# EasyEDA Pro project 最小系统板.eprj

# Schematic Schematic1
Board Name: Board1; Create Date: 2025-12-22; Page Name: P1; Project Name: 最小系统板; Schematic Name: Schematic1; Update Date: 2025-12-23; Company: 嘉立创EDA; Page Size: A4; Version: V1.0
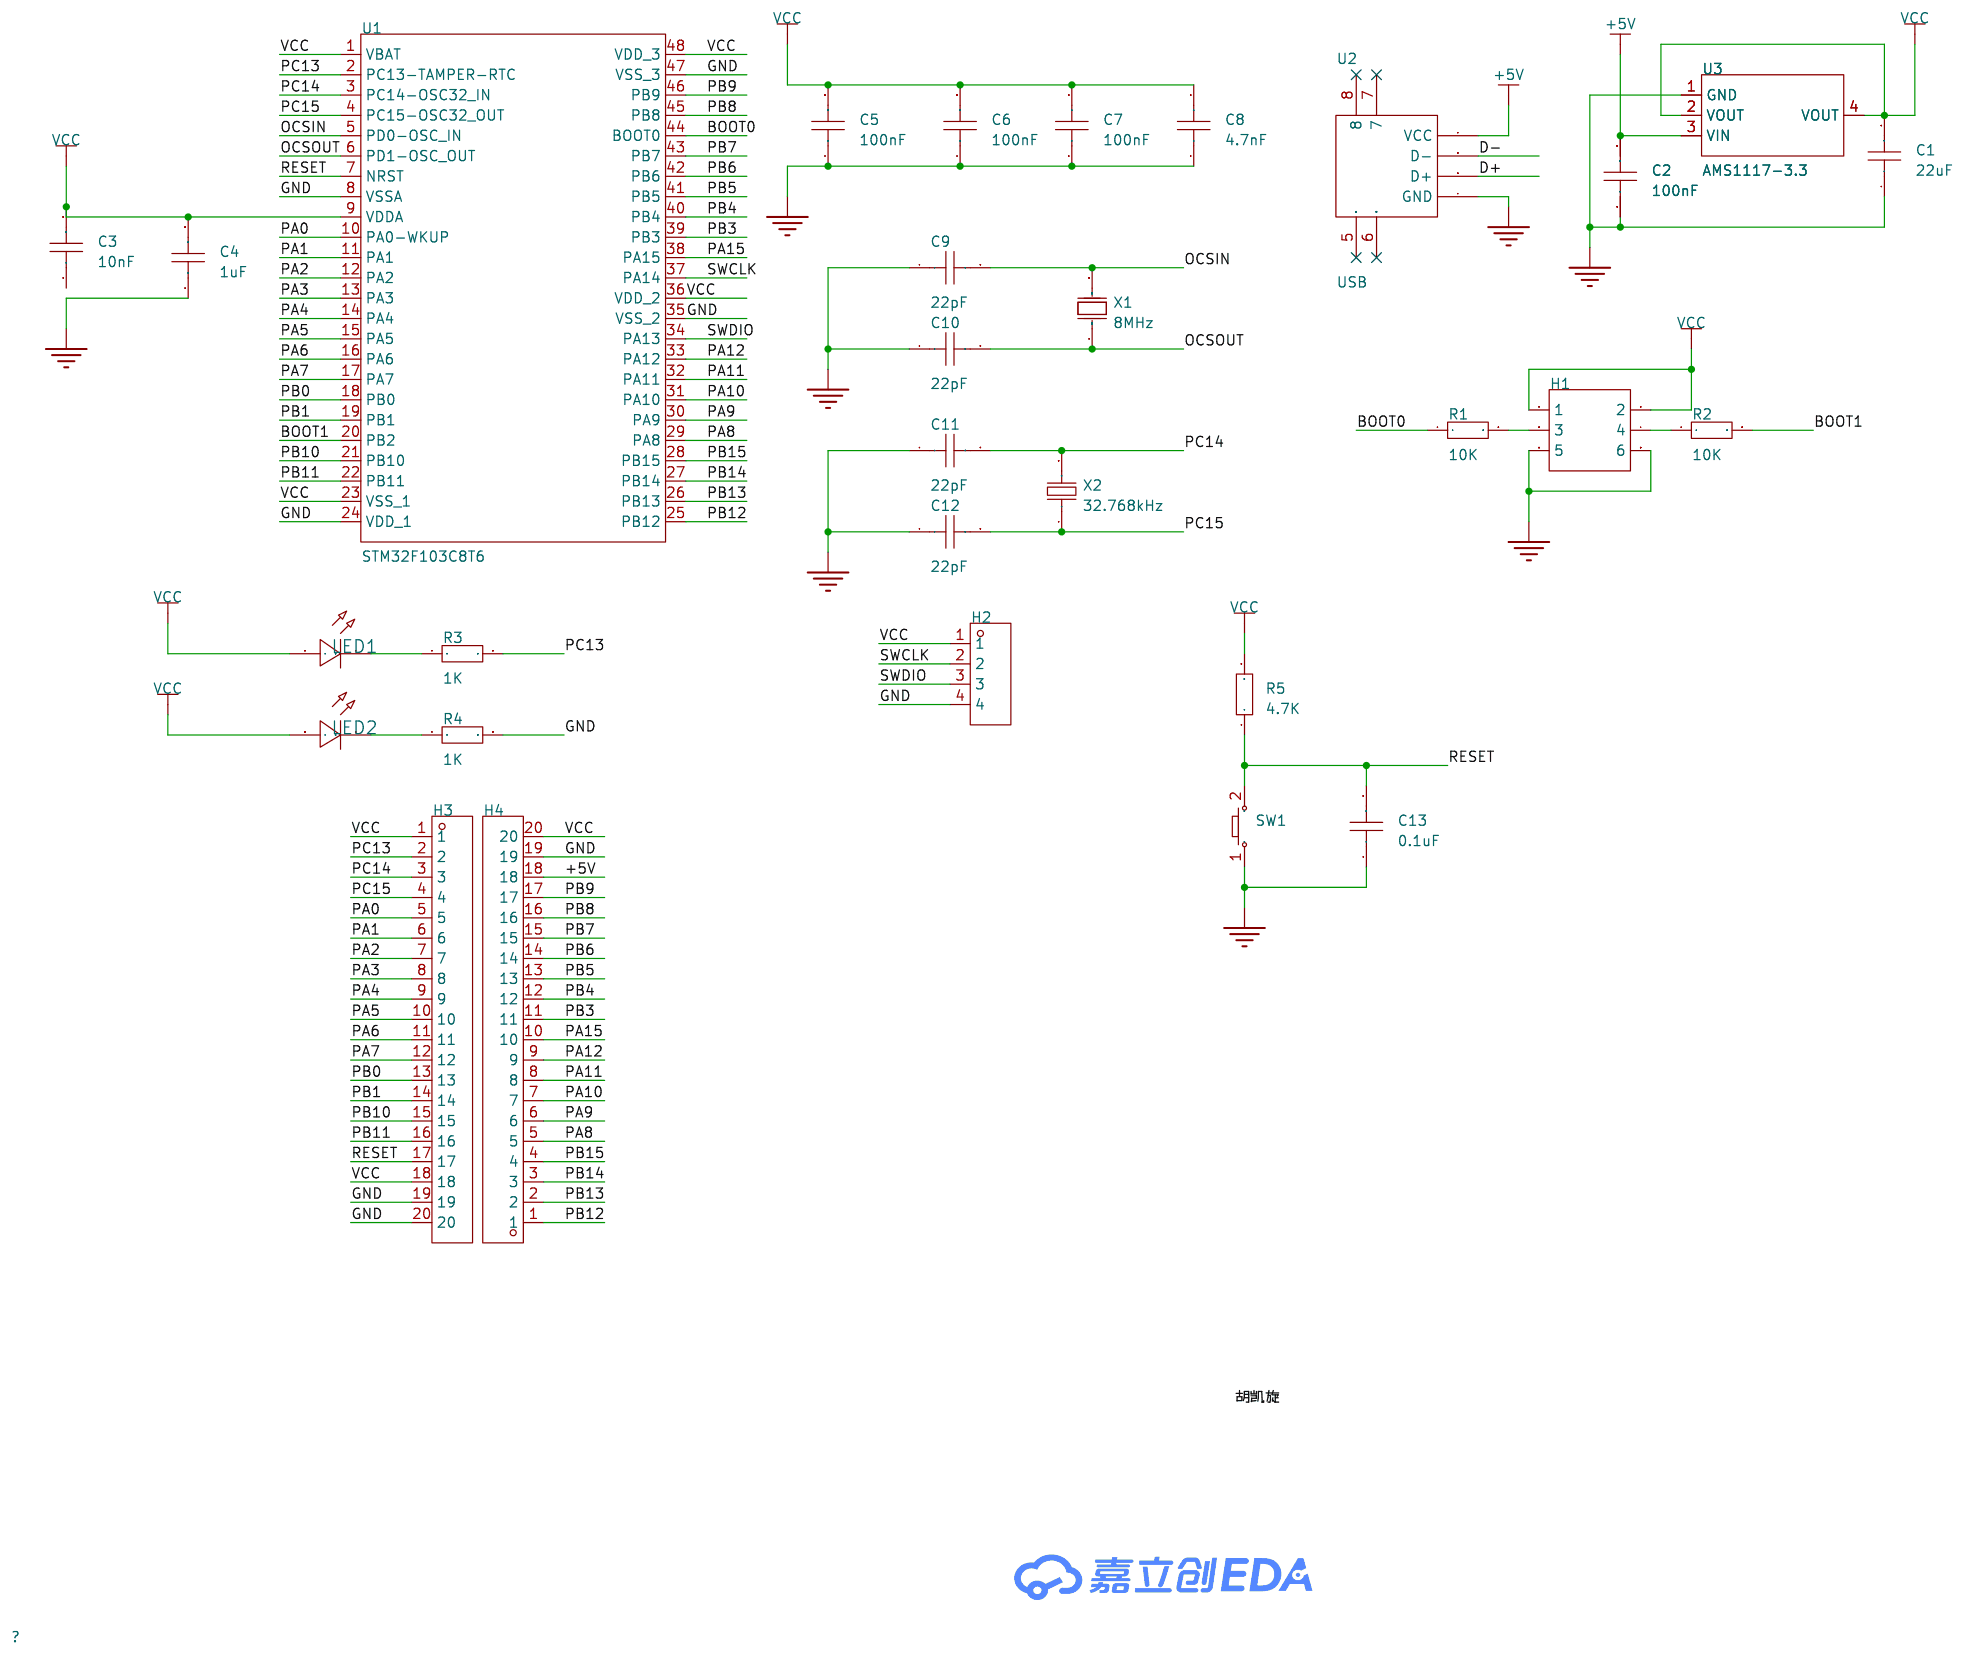
[diagram p0: schematic sheet]

## Parts
C1  22uF  [C0603]
C2  100nF  [C0603]
C3  10nF  [C0603]
C4  1uF  [C0603]
C5  100nF  [C0603]
C6  100nF  [C0603]
C7  100nF  [C0603]
C8  4.7nF  [C0603]
C9  22pF  [C0603]
C10  22pF  [C0603]
C11  22pF  [C0603]
C12  22pF  [C0603]
C13  0.1uF  [C0603]
H1  -  [HDR-TH_6P-P2.54-V-F-R2-C3-S2.54]
H2  -  [HDR-TH_4P-P2.54-V-M]
H3  -  [HDR-TH_20P-P2.54-V-M-1]
H4  -  [HDR-TH_20P-P2.54-V-M-1]
LED1  -  [LED_0603]
LED2  -  [LED_0603]
R1  10K  [R0603]
R2  10K  [R0603]
R3  1K  [R0603]
R4  1K  [R0603]
R5  4.7K  [R0603]
SW1  -  [Key_SMD_3x4x2]
U1  STM32F103C8T6  [LQFP-48_L7.0-W7.0-P0.50-LS9.0-BL]
U2  USB  [USB-SMD_USB_1]
U3  AMS1117-3.3  [SOT-223-3_L6.5-W3.4-P2.30-LS7.0-BR]
X1  8MHz  [CRYSTAL-SMD_L5.0-W3.2]
X2  32.768kHz  [FC-135R_L3.2-W1.5]

## Library data of the parts
C1-C13 = CAP_0603: Supplier Footprint: 0603
H1 = HDR-F_2.54_2x3: Supplier Part: C92272; Supplier Footprint: 插件
H2 = HDR-M_2.54_1x4P: Supplier Part: C492403; Supplier Footprint: 插件
H3 H4 = HDR-M_2.54_1x20P: Supplier Part: C50981; Supplier Footprint: 插件
LED1 LED2 = LED_0603-R: Supplier Footprint: 0603
R1-R5 = Res_0603: Supplier Footprint: 0603
SW1 = Key_SMD_3x4x2: Supplier Footprint: SMD
U1 = STM32F103C8T6: LCSC Part Name: 主流增强型ARM Cortex-M3 MCU，具有64 KB Flash、72 MHz CPU、电机控制、USB和CAN; Supplier Part: C8734; Manufacturer: ST(意法半导体); Supplier Footprint: LQFP-48(7x7); JLCPCB Part Class: 扩展库; Datasheet: https://item.szlcsc.com/datasheet/STM32F103C8T6/9243.html; Supplier: LCSC; CPU Core: ARM-M3; CPU Maximum Speed: 72MHz; Program Storage Size: 64KB; Program Memory Type: FLASH; Number of I/O: 37; ADC (Bit): 12bit; Voltage - Supply: 2V~3.6V
U2 = USB: Supplier Part: C9900237861; Supplier Footprint: SMD; JLCPCB Part Class: 扩展库; Supplier: LCSC
U3 = AMS1117-3.3_C6186: LCSC Part Name: 输出3.3V 1A; Supplier Part: C6186; Manufacturer: AMS; Supplier Footprint: SOT-223; JLCPCB Part Class: 基础库; Datasheet: https://item.szlcsc.com/datasheet/AMS1117-3.3/6652.html; Supplier: LCSC; Output Type: 固定; Voltage - Supply: 16V; Output Voltage: 3.3V; Output Current: 1A; Power Supply Rejection Ratio (PSRR): 72dB@(120Hz); Voltage Dropout: 1.1V@(800mA); standby current: 5mA; Noise: 0.003%Vout; Features: 过流保护；过热保护; Operating Temperature: -40℃~+125℃; Output Configuration: 正极; Number of Outputs: 1
X1 = X50328MSB2GI: LCSC Part Name: YSX530GA 8MHZ 2P 5032 20PF ±10PPM -40~85℃ (±20PPM); Supplier Part: C115962; Manufacturer: YXC(扬兴晶振); Supplier Footprint: SMD5032-2P; JLCPCB Part Class: 基础库; Datasheet: https://item.szlcsc.com/datasheet/X50328MSB2GI/117214.html; Supplier: LCSC; Type: 贴片晶振; Normal temperature Frequency Tolerance: ±10ppm; Load Capacitance: 20pF; Frequency Stability: ±20ppm; Operating Temperature: -40℃~+85℃
X2 = Q13FC13500004_C32346: LCSC Part Name: 32.768kHz ±20ppm 12.5pF; Supplier Part: C32346; Manufacturer: EPSON(爱普生); Manufacturer Part: Q13FC13500004; Supplier Footprint: SMD3215-2P; JLCPCB Part Class: 基础库; Datasheet: https://item.szlcsc.com/datasheet/Q13FC13500004/33310.html; Supplier: LCSC; Type: 贴片晶振; Normal temperature Frequency Tolerance: ±20ppm; Load Capacitance: 12.5pF; Equivalent Series Resistance(ESR): 70kΩ; Operating Temperature: -40℃~+85℃

## Nets
+5V: C2.2 H4.18 U2.1(VCC) U3.3(VIN)
GND: C1.1 C2.1 C4.1 C5.1 C6.1 C7.1 C8.1 C9.1 C10.1 C11.1 C12.1 C13.1 H1.5 H1.6 H2.4 H3.19 H3.20 H4.19 R4.2 SW1.1 U1.8(VSSA) U1.24(VDD_1) U1.35(VSS_2) U1.47(VSS_3) U2.4(GND) U3.1(GND)
VCC: C1.2 C3.2 C4.2 C5.2 C6.2 C7.2 C8.2 H1.1 H1.2 H2.1 H3.1 H3.18 H4.20 LED1.2(A) LED2.2(A) R5.2 U1.1(VBAT) U1.9(VDDA) U1.23(VSS_1) U1.36(VDD_2) U1.48(VDD_3) U3.2(VOUT) U3.4(VOUT)
BOOT0: R1.1 U1.44(BOOT0)
BOOT1: R2.2 U1.20(PB2)
D+: U2.3(D+)
D-: U2.2(D-)
OCSIN: C9.2 U1.5(PD0-OSC_IN) X1.2(OSC2)
OCSOUT: C10.2 U1.6(PD1-OSC_OUT) X1.1(OSC1)
PA0: H3.5 U1.10(PA0-WKUP)
PA1: H3.6 U1.11(PA1)
PA2: H3.7 U1.12(PA2)
PA3: H3.8 U1.13(PA3)
PA4: H3.9 U1.14(PA4)
PA5: H3.10 U1.15(PA5)
PA6: H3.11 U1.16(PA6)
PA7: H3.12 U1.17(PA7)
PA8: H4.5 U1.29(PA8)
PA9: H4.6 U1.30(PA9)
PA10: H4.7 U1.31(PA10)
PA11: H4.8 U1.32(PA11)
PA12: H4.9 U1.33(PA12)
PA15: H4.10 U1.38(PA15)
PB0: H3.13 U1.18(PB0)
PB1: H3.14 U1.19(PB1)
PB3: H4.11 U1.39(PB3)
PB4: H4.12 U1.40(PB4)
PB5: H4.13 U1.41(PB5)
PB6: H4.14 U1.42(PB6)
PB7: H4.15 U1.43(PB7)
PB8: H4.16 U1.45(PB8)
PB9: H4.17 U1.46(PB9)
PB10: H3.15 U1.21(PB10)
PB11: H3.16 U1.22(PB11)
PB12: H4.1 U1.25(PB12)
PB13: H4.2 U1.26(PB13)
PB14: H4.3 U1.27(PB14)
PB15: H4.4 U1.28(PB15)
PC13: H3.2 R3.2 U1.2(PC13-TAMPER-RTC)
PC14: C11.2 H3.3 U1.3(PC14-OSC32_IN) X2.2
PC15: C12.2 H3.4 U1.4(PC15-OSC32_OUT) X2.1
RESET: C13.2 H3.17 R5.1 SW1.2 U1.7(NRST)
SWCLK: H2.2 U1.37(PA14)
SWDIO: H2.3 U1.34(PA13)
$1N1965: H1.3 R1.2
$1N1969: H1.4 R2.1
$1N2185: LED1.1(C) R3.1
$1N2189: LED2.1(C) R4.1

Not connected (* = marked no-connect by the designer): C3 1; U2 5(SH1)* 6(SH2)* 7* 8*

## Notes on the sheet
- 胡凯旋

# Board PCB1
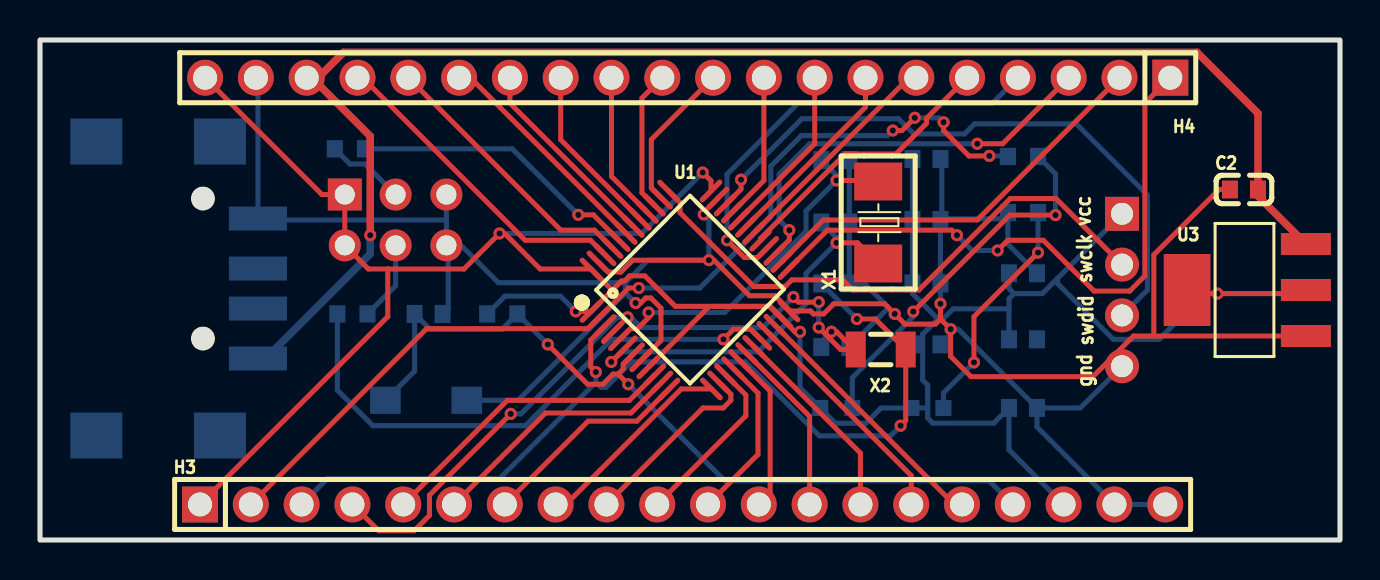
[diagram p1: board, top side]
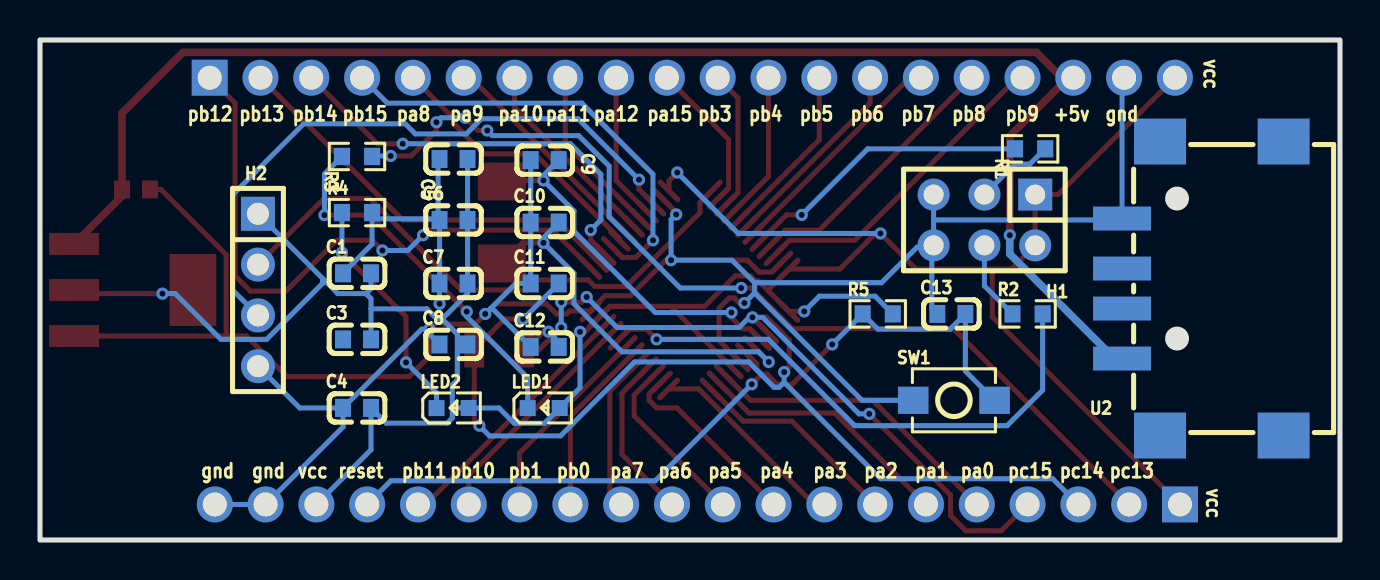
[diagram p2: board, bottom side, seen from below]

Outline 65 x 25 mm; copper layers: Top Layer, Bottom Layer. Coordinates in mm from the lower left corner of the outline.
Outline path: rectangle 0,25 65,0
Stack: Top Layer 0.035mm / Dielectric1 1.51mm FR4 er 4.5 / Bottom Layer 0.035mm

## Design rules (mm)
template: 自定义配置
spacing copperThickness1oz (default): track to track 0.152, other pairs 0.152 to 0.3
spacing copperThickness2oz: track to track 0.203, other pairs 0.152 to 0.3
track width copperThickness1oz (default): min 0.254, default 0.254, max 0.762
track width copperThickness2oz: min 0.203, default 0.254, max 2.54
track width 5V: min 0.381, default 0.381, max 0.762
differential pair differentialPair (default): width min 0.127, default 0.254, max 2.54; gap min 0.152, default 0.152
via viaSize (default): diameter min 0.5, default 0.61, max 10; hole min 0.3, default 0.305, max 6.3
net +5V uses 5V

## Placement (name value [footprint] x y rotation side)
C1  22uF  [C0603]  49.15 13.33 180 bottom
C2  100nF  [C0603]  60.2 17.53 0 top
C3  10nF  [C0603]  49.15 10.03 180 bottom
C4  1uF  [C0603]  49.15 6.6 180 bottom
C5  100nF  [C0603]  44.32 19.05 180 bottom
C6  100nF  [C0603]  44.32 16 180 bottom
C7  100nF  [C0603]  44.32 12.83 180 bottom
C8  4.7nF  [C0603]  44.32 9.78 180 bottom
C9  22pF  [C0603]  39.76 18.99 180 bottom
C10  22pF  [C0603]  39.76 15.88 180 bottom
C11  22pF  [C0603]  39.76 12.83 180 bottom
C12  22pF  [C0603]  39.76 9.65 180 bottom
C13  0.1uF  [C0603]  19.43 11.3 180 bottom
H1  -  [HDR-TH_6P-P2.54-V-F-R2-C3-S2.54]  17.78 16 0 bottom
H2  -  [HDR-TH_4P-P2.54-V-M]  54.1 12.5 270 bottom
H3  -  [HDR-TH_20P-P2.54-V-M-1]  32.13 1.78 0 top
H4  -  [HDR-TH_20P-P2.54-V-M-1]  32.38 23.11 180 top
LED1  -  [LED_0603]  39.76 6.6 180 bottom
LED2  -  [LED_0603]  44.32 6.6 180 bottom
R1  10K  [R0603]  15.49 19.56 180 bottom
R2  10K  [R0603]  15.62 11.3 180 bottom
R3  1K  [R0603]  49.15 19.18 180 bottom
R4  1K  [R0603]  49.15 16.37 180 bottom
R5  4.7K  [R0603]  23.11 11.3 180 bottom
SW1  -  [Key_SMD_3x4x2]  19.3 6.98 180 bottom
U1  STM32F103C8T6  [LQFP-48_L7.0-W7.0-P0.50-LS9.0-BL]  32.5 12.5 315.1 top
U2  USB  [USB-SMD_USB_1]  6.86 12.57 90 bottom
U3  AMS1117-3.3  [SOT-223-3_L6.5-W3.4-P2.30-LS7.0-BR]  60.32 12.5 0 top
X1  8MHz  [CRYSTAL-SMD_L5.0-W3.2]  41.91 15.88 90 top
X2  32.768kHz  [FC-135R_L3.2-W1.5]  42.04 9.53 0 top

## Footprints (pads in the part's own frame, mm; a bottom-side part is the same pattern mirrored in y, then rotated)
C0603
  rect 0.8x0.9 smd: 1(-0.7,0) 2(0.7,0)
CRYSTAL-SMD_L5.0-W3.2
  rect 1.9x2.4 smd: 1(-2.05,0) 2(2.05,0)
FC-135R_L3.2-W1.5
  rect 1x1.8 smd: 1(-1.25,0) 2(1.25,0)
HDR-TH_4P-P2.54-V-M
  rect 1.7x1.7 hole 1.1: 1(-3.81,0)
  round 1.7 hole 1.1: 2(-1.27,0) 3(1.27,0) 4(3.81,0)
HDR-TH_6P-P2.54-V-F-R2-C3-S2.54
  rect 1.7x1.6 hole 1: 1(-2.54,-1.27)
  round 1.6 hole 1: 2(-2.54,1.27) 3(0,-1.27) 4(0,1.27) 5(2.54,-1.27) 6(2.54,1.27)
HDR-TH_20P-P2.54-V-M-1
  rect 1.8x1.8 hole 1.2: 1(-24.13,0)
  round 1.8 hole 1.2: 2(-21.59,0) 3(-19.05,0) 4(-16.51,0) 5(-13.97,0) 6(-11.43,0) 7(-8.89,0) 8(-6.35,0) 9(-3.81,0) 10(-1.27,0) 11(1.27,0) 12(3.81,0) 13(6.35,0) 14(8.89,0) 15(11.43,0) 16(13.97,0) 17(16.51,0) 18(19.05,0) 19(21.59,0) 20(24.13,0)
Key_SMD_3x4x2
  rect 1.53x1.36 smd: 1(-2.035,0) 2(2.035,0)
LED_0603
  rect 0.8x0.8 smd: 1(-0.851,-0.01) 2(0.75,-0.005)
LQFP-48_L7.0-W7.0-P0.50-LS9.0-BL
  oval 0.27x1.5 smd: 1(-2.75,-4.25) 2(-2.25,-4.25) 3(-1.75,-4.25) 4(-1.25,-4.25) 5(-0.75,-4.25) 6(-0.25,-4.25) 7(0.25,-4.25) 8(0.75,-4.25) 9(1.25,-4.25) 10(1.75,-4.25) 11(2.25,-4.25) 12(2.75,-4.25) 25(2.75,4.25) 26(2.25,4.25) 27(1.75,4.25) 28(1.25,4.25) 29(0.75,4.25) 30(0.25,4.25) 31(-0.25,4.25) 32(-0.75,4.25) 33(-1.25,4.25) 34(-1.75,4.25) 35(-2.25,4.25) 36(-2.75,4.25)
  oval 1.5x0.27 smd: 13(4.25,-2.75) 14(4.25,-2.25) 15(4.25,-1.75) 16(4.25,-1.25) 17(4.25,-0.75) 18(4.25,-0.25) 19(4.25,0.25) 20(4.25,0.75) 21(4.25,1.25) 22(4.25,1.75) 23(4.25,2.25) 24(4.25,2.75) 37(-4.25,2.75) 38(-4.25,2.25) 39(-4.25,1.75) 40(-4.25,1.25) 41(-4.25,0.75) 42(-4.25,0.25) 43(-4.25,-0.25) 44(-4.25,-0.75) 45(-4.25,-1.25) 46(-4.25,-1.75) 47(-4.25,-2.25) 48(-4.25,-2.75)
R0603
  rect 0.806x0.864 smd: 1(-0.753,0) 2(0.753,0)
SOT-223-3_L6.5-W3.4-P2.30-LS7.0-BR
  rect 2.5x1.1 smd: 1(2.97,-2.3) 2(2.97,0) 3(2.97,2.3)
  rect 2.34x3.6 smd: 4(-2.97,0)
USB-SMD_USB_1
  rect 1.2x2.9 smd: 1(-3.5,4.04) 2(-1,4.04) 3(1,4.04) 4(3.5,4.04)
  rect 2.3x2.6 smd: 5(7.35,2.14) 6(7.35,-4.04) 7(-7.35,-4.04) 8(-7.35,2.14)

## Nets
As in the schematic.

Pads without a net: C3 1; U2 5 6 7 8

## Via types
v1: diameter 0.61, hole 0.305, Top Layer to Bottom Layer, 44 vias

## Routing (per net, layer and track width the routed paths; a pad name or vN(x,y) marks a point on that pad's centre or on a via; arc(x,y) is an arc through that point)
+5V: length 74.9
  Top Layer w0.381: 13.46,23.24 14.03,23.24 15.18,24.38 57.85,24.38 60.9,21.34 C2.2 60.9,17.2 U3.3 ; 13.46,23.24 16.51,20.19 v1(16.51,15.24) ; 13.46,23.24 13.34,23.11
  Bottom Layer w0.381: v1(16.51,15.24) 16.51,14.3 11.28,9.07 U2.1
GND: length 154.1
  Top Layer w0.254: 37.51,11.45 36.75,12.21 35.48,12.21 33.7,13.99 v1(33.45,13.99) 29.64,13.99 29.04,13.4 28.41,13.4 U1.47 ; 37.51,11.45 37.45,11.45 ; 37.51,11.45 38.53,11.45 38.67,11.3 39.18,11.3 39.69,11.81 42.23,11.81 v1(42.74,11.3) 43.25,10.8 44.77,10.8 45.02,11.05 ; C2.1 58.95,17.53 55.69,14.26 55.69,10.2 ; v1(33.19,16.28) 33.19,16.39 U1.35 ; v1(45.02,11.81) 45.02,11.05 ; 45.02,11.05 v1(45.53,10.54) 45.53,9.18 46.55,8.17 52.64,8.17 54.68,10.2 55.69,10.2 ; 55.69,10.2 U3.1 ; v1(29.78,11.85) 30.03,11.85 30.29,12.1 30.54,12.1 31.05,11.59 31.05,9.97 30.03,8.96
  Bottom Layer w0.254: 42.48,11.56 42.37,11.56 C12.1 ; 42.48,11.56 41.21,12.83 C11.1 C10.1 C9.1 ; 42.48,11.56 v1(42.74,11.3) ; 48.4,16.06 45.09,16.06 ; 48.4,16.06 R4.2 ; 48.4,16.06 48.4,14.79 C1.1 ; 45.09,16.06 C6.1 C7.1 v1(45.02,11.81) ; 45.09,16.06 45.09,18.98 C5.1 ; 29.27,12.36 v1(29.78,11.85) ; 29.27,12.36 23.9,6.98 SW1.1 ; 29.27,12.36 29.27,12.86 ; H3.20 H3.19 49.85,5.65 C4.1 ; v1(33.19,16.28) 33.45,16.02 v1(33.45,13.99) 30.4,13.99 29.27,12.86 ; 20.32,16 H1.5 ; 20.32,16 10.97,16 U2.4 10.9,23.01 H4.19 ; 20.32,16 H1.6 20.41,14.64 ; 29.27,12.86 22.92,12.86 21.14,14.64 20.41,14.64 ; C4.1 45.91,10.54 v1(45.53,10.54) 45.53,10.29 C8.1 ; C4.1 52.02,6.6 H2.4 ; C13.1 20.41,11.58 20.41,14.64
VCC: length 148.3
  Top Layer w0.254: 37.1,11.06 U1.23 36.51,11.68 31.77,11.68 30.24,13.21 29.48,13.21 29.23,12.95 29.08,12.95 28.57,12.44 ; 37.1,11.06 37.75,10.41 v1(38,10.41) ; 37.1,11.06 36.48,11.68 33.46,11.68 U1.9 ; 17.39,13.55 16.42,13.55 H1.2 H1.1 14.1,17.27 H4.20 ; 17.39,13.55 17.39,11.17 H3.1 ; 17.39,13.55 21.2,13.55 v1(22.98,15.33) 23.23,15.33 25.01,13.55 27.55,13.55 28.57,12.53 28.57,12.44 ; v1(33.14,18.38) 33.55,17.96 33.55,17.45 ; v1(26.79,11.43) U1.1 28.57,12.44 ; U3.4 57.54,12.32 v1(58.88,12.32) 63.11,12.32 U3.2
  Bottom Layer w0.254: 44.13,9.78 44.13,8 44.38,7.75 44.38,6.6 ; 44.13,9.78 44.13,10.29 44.89,11.05 ; 44.13,9.78 C8.2 ; 48.7,12.32 48.45,12.06 48.45,11.56 ; 48.7,12.32 50.11,12.32 50.87,13.08 ; 48.7,12.32 48.45,12.57 C1.2 ; v1(58.88,12.32) 58.24,12.32 55.95,10.03 53.67,10.03 50.87,12.83 50.87,13.08 ; 44.38,6.6 44.38,6.1 44.64,5.84 47.69,5.84 C4.2 48.45,4.51 H3.18 ; 44.38,6.6 43.58,6.6 ; R5.2 23.25,12.19 26.03,12.19 v1(26.79,11.43) ; 48.45,11.56 45.66,11.56 45.15,11.05 44.89,11.05 ; 48.45,11.56 C3.2 ; 44.89,11.05 43.62,12.32 C7.2 C6.2 C5.2 ; 50.87,13.08 H2.1 ; v1(33.14,18.38) 30.09,15.33 v1(22.98,15.33) ; v1(38,10.41) 38,7.61 LED1.2 39.78,5.84 41.29,5.84 42.05,6.6 LED2.2
BOOT0: length 14.6
  Top Layer w0.254: 28.96,14.97 27.67,16.26 v1(26.92,16.26)
  Bottom Layer w0.254: v1(26.92,16.26) 23.61,19.56 R1.1
BOOT1: length 27.9
  Top Layer w0.254: v1(34.17,10.03) 34.68,10.54 35.53,10.54 36.04,10.03
  Bottom Layer w0.254: R2.2 14.87,7.49 16.65,5.72 24.27,5.72 28.58,10.03 v1(34.17,10.03)
OCSIN: length 18.3
  Top Layer w0.254: v1(30.43,11.37) 30.43,11.12 29.87,10.56 29.51,10.56 28.97,10.02 ; X1.2 41.86,17.98 v1(39.83,17.98)
  Bottom Layer w0.254: v1(30.43,11.37) 34.24,11.37 38.3,15.44 38.3,16.45 v1(39.83,17.98) 39.83,18.23 C9.2
OCSOUT: length 19.5
  Top Layer w0.254: v1(39.83,14.86) 40.88,14.86 X1.1 ; v1(28.56,8.9) U1.6
  Bottom Layer w0.254: C10.2 39.83,15.11 v1(39.83,14.86) 38.3,13.33 38.3,11.81 35.9,9.41 29.07,9.41 v1(28.56,8.9)
PA0: length 15.3
  Top Layer w0.254: H3.5 23.37,6.98 29.47,6.98 U1.10
PA1: length 12.9
  Top Layer w0.254: H3.6 25.27,6.35 29.55,6.35 U1.11
PA2: length 10.6
  Top Layer w0.254: 31.45,7.55 29.84,5.94 27.41,5.94 H3.7
PA3: length 10.2
  Top Layer w0.254: H3.8 26.29,1.78 32.06,7.55 U1.13
PA4: length 9.6
  Top Layer w0.254: U1.14 34.54,7.29 34.54,6.98 34.16,6.6 33.15,6.6 H3.9
PA5: length 8.7
  Top Layer w0.254: U1.15 35.29,7.25 35.29,6.21 H3.10
PA6: length 8.4
  Top Layer w0.254: U1.16 35.9,7.35 35.9,4.28 H3.11
PA7: length 8.1
  Top Layer w0.254: H3.12 36.51,2.34 36.51,7.45 34.98,8.97
PA8: length 13.9
  Top Layer w0.254: H4.5 44.32,21.08 44.32,20.83 42.8,19.3 40.26,19.3 36.03,15.08 36.03,14.98
PA9: length 11.4
  Top Layer w0.254: U1.30 43.45,23.11 H4.6
PA10: length 9.9
  Top Layer w0.254: 41.28,23.11 41.28,21.64 35.32,15.69
PA11: length 8.6
  Top Layer w0.254: 38.74,23.11 38.74,19.81 34.97,16.04
PA12: length 7.4
  Top Layer w0.254: H4.9 36.19,17.98 U1.33
PA15: length 7.5
  Top Layer w0.254: U1.38 30.57,17.6 30.57,20.03 H4.10
PB0: length 8.8
  Top Layer w0.254: U1.18 38.48,6.18 H3.13
PB1: length 10.1
  Top Layer w0.254: 41.02,1.78 41.02,4.35 35.69,9.68
PB3: length 7.1
  Top Layer w0.254: U1.39 30.1,17.36 30.1,22.1 31.12,23.11
PB4: length 7.5
  Top Layer w0.254: U1.40 28.57,18.18 H4.12
PB5: length 8.7
  Top Layer w0.254: H4.13 26.03,20.01 30.02,16.03
PB6: length 10
  Top Layer w0.254: U1.42 23.5,21.84 H4.14
PB7: length 11.6
  Top Layer w0.254: 29.31,15.32 21.52,23.11 20.96,23.11
PB8: length 13.7
  Top Layer w0.254: H4.16 26.03,15.49 27.72,15.49 U1.45
PB9: length 16
  Top Layer w0.254: H4.17 16.13,23.11 24.26,14.99 27.53,14.99 U1.46
PB10: length 11.6
  Top Layer w0.254: H3.15 43.56,3.22 U1.21
PB11: length 13.1
  Top Layer w0.254: U1.22 45.71,1.78 H3.16
PB12: length 31
  Top Layer w0.254: v1(45.85,15.24) 45.59,15.49 39.37,15.49 U1.25 ; H4.1 55.25,21.84 55.25,13.21 54.48,12.45 52.71,12.45 50.16,14.99 48.39,14.99 v1(47.88,14.48)
  Bottom Layer w0.254: v1(47.88,14.48) 46.61,14.48 v1(45.85,15.24)
PB13: length 20.7
  Top Layer w0.254: U1.26 39.17,16 46.86,16 H4.2
PB14: length 21
  Top Layer w0.254: v1(46.86,19.81) 48.13,19.81 H4.3 ; v1(37.47,15.49) 37.47,15 U1.27
  Bottom Layer w0.254: v1(46.86,19.81) 38.48,19.81 36.96,18.29 36.96,16 v1(37.47,15.49)
PB15: length 22.4
  Top Layer w0.254: v1(34.35,14.99) 35.22,14.12 35.88,14.12 U1.28
  Bottom Layer w0.254: 48.9,23.11 47.62,21.84 37.91,21.84 34.35,18.29 v1(34.35,14.99)
PC13: length 48.4
  Top Layer w0.254: v1(45.18,20.89) 45.18,20.47 46.45,19.2 v1(47.47,19.2) ; v1(43.74,21.11) 43.1,20.47 v1(42.64,20.47) ; H3.2 19.33,10.57 27.4,10.57 U1.2 29.43,12.6 v1(29.94,12.6)
  Bottom Layer w0.254: R3.2 48.37,19.2 v1(47.47,19.2) ; v1(43.74,21.11) 44.96,21.11 v1(45.18,20.89) ; v1(29.94,12.6) 32.99,12.6 36.54,16.16 36.54,18.7 38.07,20.22 42.38,20.22 v1(42.64,20.47)
PC14: length 47.6
  Top Layer w0.254: v1(43.03,5.72) 43.29,5.97 X2.2 41.76,11.05 v1(40.84,11.05) ; U1.3 27.54,10 27.54,8.65 v1(27.79,8.4)
  Bottom Layer w0.254: H3.3 14.37,3.06 22.97,3.06 27.79,7.89 ; v1(43.03,5.72) 42.53,5.21 38.97,5.21 35.27,8.91 29.57,8.91 28.3,7.64 28.05,7.64 27.79,7.89 ; C11.2 v1(40.84,11.05) ; 27.79,7.89 v1(27.79,8.4)
PC15: length 37
  Top Layer w0.254: 40.72,9.53 39.83,10.41 v1(39.57,10.41) ; 40.72,9.53 X2.1 ; 40.72,9.53 40.04,9.53 v1(38.94,10.62) ; v1(29.38,11.13) U1.4 ; v1(37.67,12.15) 37.92,11.89 v1(38.94,11.89) ; v1(23.54,6.31) 19.47,2.24 19.47,1.23 18.71,0.46 16.94,0.46 H3.4
  Bottom Layer w0.254: C12.2 39.06,9.91 v1(39.57,10.41) ; v1(23.54,6.31) 24.04,6.31 28.87,11.13 v1(29.38,11.13) 29.54,11.13 30.05,10.62 36.14,10.62 v1(37.67,12.15) ; v1(38.94,10.62) v1(38.94,11.89)
RESET: length 41.2
  Top Layer w0.254: v1(25.39,9.78) 27.38,7.79 28.14,7.79 28.65,8.3 28.91,8.3 ; 28.91,8.3 v1(29.41,7.79) ; 28.91,8.3 29.16,8.55 29.16,8.79 29.68,9.31
  Bottom Layer w0.254: SW1.2 18.73,8.45 C13.2 19.49,10.54 23.11,10.54 R5.1 v1(25.39,9.78) ; H3.17 47.46,2.96 34.24,2.96 v1(29.41,7.79)
SWCLK: length 28.6
  Top Layer w0.254: H2.2 50.8,17.07 48.51,17.07 43.94,12.5 40.64,12.5 40.13,13.01 37.59,13.01 37.26,12.68 35.69,12.68 32,16.36 32,16.87 U1.37
SWDIO: length 31.7
  Top Layer w0.254: v1(35.05,18.02) 35.05,17.54 U1.34
  Bottom Layer w0.254: H2.3 55.37,12.5 55.37,17.25 51.82,20.81 46.74,20.81 46.23,20.3 43.69,20.3 42.93,21.06 38.1,21.06 v1(35.05,18.02)
$1N1965: length 4
  Bottom Layer w0.254: R1.2 15.5,18.8 16.26,18.8 H1.3
$1N1969: length 4
  Bottom Layer w0.254: H1.4 17.78,12.71 R2.1
$1N2185: length 18.5
  Top Layer w0.254: v1(50.78,16.25) 48.49,16.25 v1(43.66,11.42)
  Bottom Layer w0.254: R3.1 50.78,18.3 v1(50.78,16.25) ; LED1.1 40.62,8.12 43.66,11.17 v1(43.66,11.42)
$1N2189: length 11.7
  Top Layer w0.254: v1(49.9,14.37) 46.7,11.17 v1(46.7,8.88)
  Bottom Layer w0.254: v1(46.7,8.88) 45.17,7.36 LED2.1 ; v1(49.9,14.37) R4.1

## Text on the board
Bottom Silkscreen Layer: vcc | pc13 | gnd | pc14 | +5v | pc15 | pb9 | pa0 | pb8 | pa1 | pb7 | pa2 | pb6 | pa3 | pb5 | pa4 | pb4 | pa5 | pb3 | pa6 | pa15 | pa7 | pa12 | pb0 | pa11 | pb1 | pa10 | pa9 | pb10 | pb11 | pa8 | pb15 | reset | pb14 | pb13 | pb12
Top Silkscreen Layer: vcc | swclk | gnd | swdid
